# Altium schematic sheet STM32.SchDoc
size A
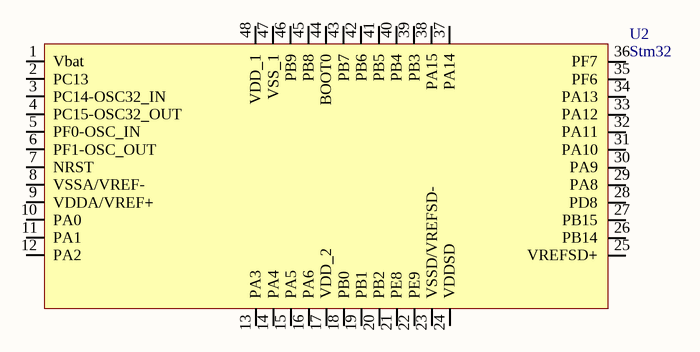
[diagram p0: STM32.SchDoc]

## Parts
U2  Stm32  [STM32F373CBT6]

## Nets

Not connected (* = marked no-connect by the designer): U2 1(Vbat) 2(PC13) 3(PC14-OSC32_IN) 4(PC15-OSC32_OUT) 5(PF0-OSC_IN) 6(PF1-OSC_OUT) 7(NRST) 8(VSSA/VREF-) 9(VDDA/VREF+) 10(PA0) 11(PA1) 12(PA2) 13(PA3) 14(PA4) 15(PA5) 16(PA6) 17(VDD_2) 18(PB0) 19(PB1) 20(PB2) 21(PE8) 22(PE9) 23(VSSD/VREFSD-) 24(VDDSD) 25(VREFSD+) 26(PB14) 27(PB15) 28(PD8) 29(PA8) 30(PA9) 31(PA10) 32(PA11) 33(PA12) 34(PA13) 35(PF6) 36(PF7) 37(PA14) 38(PA15) 39(PB3) 40(PB4) 41(PB5) 42(PB6) 43(PB7) 44(BOOT0) 45(PB8) 46(PB9) 47(VSS_1) 48(VDD_1)